# Altium schematic sheet PWM_CONTROL.SchDoc: PWM Control
size 279 x 215 mm; DrawnBy: Ethan Abraham; Engineer: Ethan Abraham; Revision: 1.0; SheetNumber: 7; SheetTotal: 7
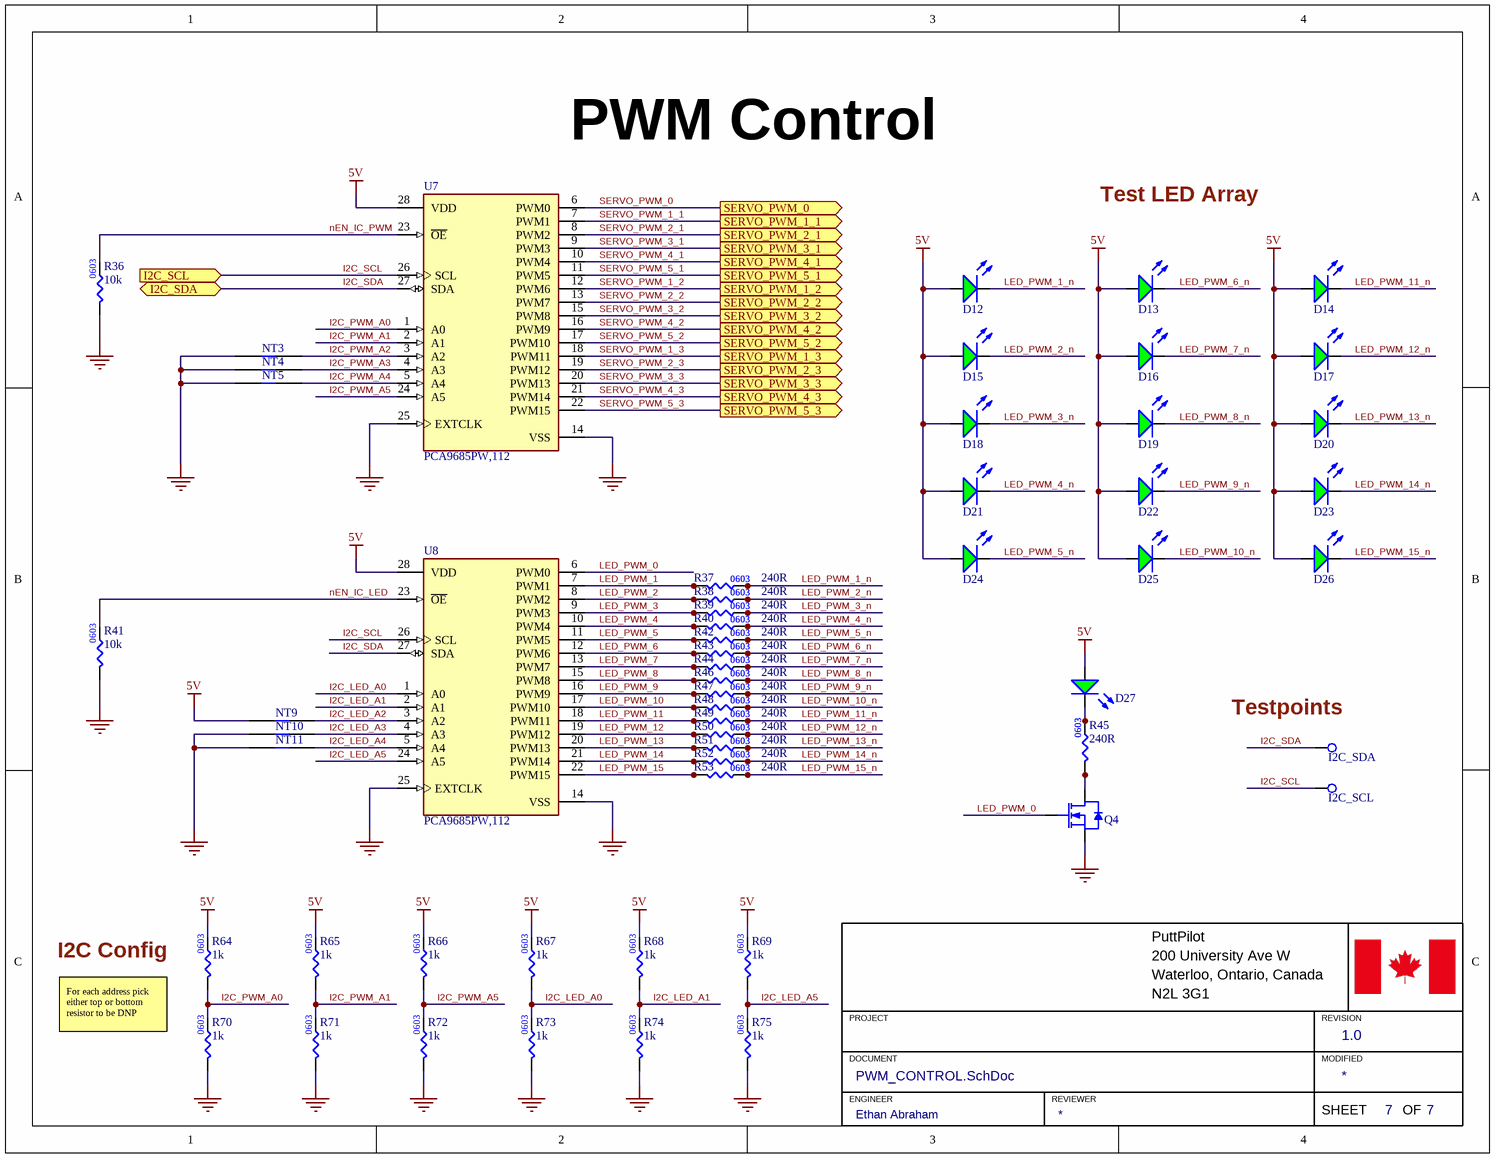
[diagram p0: PWM_CONTROL.SchDoc]

## Parts
D12  LTST-C191KGKT  [.LED_0603]  (value not drawn)
D13  LTST-C191KGKT  [.LED_0603]  (value not drawn)
D14  LTST-C191KGKT  [.LED_0603]  (value not drawn)
D15  LTST-C191KGKT  [.LED_0603]  (value not drawn)
D16  LTST-C191KGKT  [.LED_0603]  (value not drawn)
D17  LTST-C191KGKT  [.LED_0603]  (value not drawn)
D18  LTST-C191KGKT  [.LED_0603]  (value not drawn)
D19  LTST-C191KGKT  [.LED_0603]  (value not drawn)
D20  LTST-C191KGKT  [.LED_0603]  (value not drawn)
D21  LTST-C191KGKT  [.LED_0603]  (value not drawn)
D22  LTST-C191KGKT  [.LED_0603]  (value not drawn)
D23  LTST-C191KGKT  [.LED_0603]  (value not drawn)
D24  LTST-C191KGKT  [.LED_0603]  (value not drawn)
D25  LTST-C191KGKT  [.LED_0603]  (value not drawn)
D26  LTST-C191KGKT  [.LED_0603]  (value not drawn)
D27  LTST-C191KGKT  [.LED_0603]  (value not drawn)
I2C_SCL  RCWCTE  [RCWCTE]  (value not drawn)
I2C_SDA  RCWCTE  [RCWCTE]  (value not drawn)
NT3  .NET_TIE  [.NET_TIE]  (value not drawn)
NT4  .NET_TIE  [.NET_TIE]  (value not drawn)
NT5  .NET_TIE  [.NET_TIE]  (value not drawn)
NT9  .NET_TIE  [.NET_TIE]  (value not drawn)
NT10  .NET_TIE  [.NET_TIE]  (value not drawn)
NT11  .NET_TIE  [.NET_TIE]  (value not drawn)
Q4  DMN6140L-7  [.SOT-23-3]  (value not drawn)
R36  Resistance: 10k  [.RES_0603]  (hidden comment: RC0603FR-0710KL)
R37  Resistance: 240R  [.RES_0603]  (hidden comment: RC0603FR-07240RL)
R38  Resistance: 240R  [.RES_0603]  (hidden comment: RC0603FR-07240RL)
R39  Resistance: 240R  [.RES_0603]  (hidden comment: RC0603FR-07240RL)
R40  Resistance: 240R  [.RES_0603]  (hidden comment: RC0603FR-07240RL)
R41  Resistance: 10k  [.RES_0603]  (hidden comment: RC0603FR-0710KL)
R42  Resistance: 240R  [.RES_0603]  (hidden comment: RC0603FR-07240RL)
R43  Resistance: 240R  [.RES_0603]  (hidden comment: RC0603FR-07240RL)
R44  Resistance: 240R  [.RES_0603]  (hidden comment: RC0603FR-07240RL)
R45  Resistance: 240R  [.RES_0603]  (hidden comment: RC0603FR-07240RL)
R46  Resistance: 240R  [.RES_0603]  (hidden comment: RC0603FR-07240RL)
R47  Resistance: 240R  [.RES_0603]  (hidden comment: RC0603FR-07240RL)
R48  Resistance: 240R  [.RES_0603]  (hidden comment: RC0603FR-07240RL)
R49  Resistance: 240R  [.RES_0603]  (hidden comment: RC0603FR-07240RL)
R50  Resistance: 240R  [.RES_0603]  (hidden comment: RC0603FR-07240RL)
R51  Resistance: 240R  [.RES_0603]  (hidden comment: RC0603FR-07240RL)
R52  Resistance: 240R  [.RES_0603]  (hidden comment: RC0603FR-07240RL)
R53  Resistance: 240R  [.RES_0603]  (hidden comment: RC0603FR-07240RL)
R64  Resistance: 1k  [.RES_0603]  (hidden comment: RC0603FR-071KL)
R65  Resistance: 1k  [.RES_0603]  (hidden comment: RC0603FR-071KL)
R66  Resistance: 1k  [.RES_0603]  (hidden comment: RC0603FR-071KL)
R67  Resistance: 1k  [.RES_0603]  (hidden comment: RC0603FR-071KL)
R68  Resistance: 1k  [.RES_0603]  (hidden comment: RC0603FR-071KL)
R69  Resistance: 1k  [.RES_0603]  (hidden comment: RC0603FR-071KL)
R70  Resistance: 1k  [.RES_0603]  (hidden comment: RC0603FR-071KL)
R71  Resistance: 1k  [.RES_0603]  (hidden comment: RC0603FR-071KL)
R72  Resistance: 1k  [.RES_0603]  (hidden comment: RC0603FR-071KL)
R73  Resistance: 1k  [.RES_0603]  (hidden comment: RC0603FR-071KL)
R74  Resistance: 1k  [.RES_0603]  (hidden comment: RC0603FR-071KL)
R75  Resistance: 1k  [.RES_0603]  (hidden comment: RC0603FR-071KL)
U7  PCA9685PW,112  [PCA9685PW,112]
U8  PCA9685PW,112  [PCA9685PW,112]

## Ports
I2C_SCL (in), I2C_SDA (bidir), SERVO_PWM_0 (out), SERVO_PWM_1_1 (out), SERVO_PWM_1_2 (out), SERVO_PWM_1_3 (out), SERVO_PWM_2_1 (out), SERVO_PWM_2_2 (out), SERVO_PWM_2_3 (out), SERVO_PWM_3_1 (out), SERVO_PWM_3_2 (out), SERVO_PWM_3_3 (out), SERVO_PWM_4_1 (out), SERVO_PWM_4_2 (out), SERVO_PWM_4_3 (out), SERVO_PWM_5_1 (out), SERVO_PWM_5_2 (out), SERVO_PWM_5_3 (out)

## Nets
5V: D12.1(A) D13.1(A) D14.1(A) D15.1(A) D16.1(A) D17.1(A) D18.1(A) D19.1(A) D20.1(A) D21.1(A) D22.1(A) D23.1(A) D24.1(A) D25.1(A) D26.1(A) D27.1(A) NT9.1 R64.2 R65.2 R66.2 R67.2 R68.2 R69.2 U7.28(VDD) U8.28(VDD)
GND: NT3.1 NT4.1 NT5.1 NT10.1 NT11.1 Q4.2(Source) R36.1 R41.1 R70.1 R71.1 R72.1 R73.1 R74.1 R75.1 U7.14(VSS) U7.25(EXTCLK) U8.14(VSS) U8.25(EXTCLK)
I2C_LED_A0: R67.1 R73.2 U8.1(A0)
I2C_LED_A1: R68.1 R74.2 U8.2(A1)
I2C_LED_A2: NT9.2 U8.3(A2)
I2C_LED_A3: NT10.2 U8.4(A3)
I2C_LED_A4: NT11.2 U8.5(A4)
I2C_LED_A5: R69.1 R75.2 U8.24(A5)
I2C_PWM_A0: R64.1 R70.2 U7.1(A0)
I2C_PWM_A1: R65.1 R71.2 U7.2(A1)
I2C_PWM_A2: NT3.2 U7.3(A2)
I2C_PWM_A3: NT4.2 U7.4(A3)
I2C_PWM_A4: NT5.2 U7.5(A4)
I2C_PWM_A5: R66.1 R72.2 U7.24(A5)
I2C_SCL: I2C_SCL.1 U7.26(SCL) U8.26(SCL) ; port I2C_SCL
I2C_SDA: I2C_SDA.1 U7.27(SDA) U8.27(SDA) ; port I2C_SDA
LED_PWM_0: Q4.1(Gate) U8.6(PWM0)
LED_PWM_1: R37.1 U8.7(PWM1)
LED_PWM_1_n: D12.2(K) R37.2
LED_PWM_2: R38.1 U8.8(PWM2)
LED_PWM_2_n: D15.2(K) R38.2
LED_PWM_3: R39.1 U8.9(PWM3)
LED_PWM_3_n: D18.2(K) R39.2
LED_PWM_4: R40.1 U8.10(PWM4)
LED_PWM_4_n: D21.2(K) R40.2
LED_PWM_5: R42.1 U8.11(PWM5)
LED_PWM_5_n: D24.2(K) R42.2
LED_PWM_6: R43.1 U8.12(PWM6)
LED_PWM_6_n: D13.2(K) R43.2
LED_PWM_7: R44.1 U8.13(PWM7)
LED_PWM_7_n: D16.2(K) R44.2
LED_PWM_8: R46.1 U8.15(PWM8)
LED_PWM_8_n: D19.2(K) R46.2
LED_PWM_9: R47.1 U8.16(PWM9)
LED_PWM_9_n: D22.2(K) R47.2
LED_PWM_10: R48.1 U8.17(PWM10)
LED_PWM_10_n: D25.2(K) R48.2
LED_PWM_11: R49.1 U8.18(PWM11)
LED_PWM_11_n: D14.2(K) R49.2
LED_PWM_12: R50.1 U8.19(PWM12)
LED_PWM_12_n: D17.2(K) R50.2
LED_PWM_13: R51.1 U8.20(PWM13)
LED_PWM_13_n: D20.2(K) R51.2
LED_PWM_14: R52.1 U8.21(PWM14)
LED_PWM_14_n: D23.2(K) R52.2
LED_PWM_15: R53.1 U8.22(PWM15)
LED_PWM_15_n: D26.2(K) R53.2
nEN_IC_LED: R41.2 U8.23(~{OE})
nEN_IC_PWM: R36.2 U7.23(~{OE})
SERVO_PWM_0: U7.6(PWM0) ; port SERVO_PWM_0
SERVO_PWM_1_1: U7.7(PWM1) ; port SERVO_PWM_1_1
SERVO_PWM_1_2: U7.12(PWM6) ; port SERVO_PWM_1_2
SERVO_PWM_1_3: U7.18(PWM11) ; port SERVO_PWM_1_3
SERVO_PWM_2_1: U7.8(PWM2) ; port SERVO_PWM_2_1
SERVO_PWM_2_2: U7.13(PWM7) ; port SERVO_PWM_2_2
SERVO_PWM_2_3: U7.19(PWM12) ; port SERVO_PWM_2_3
SERVO_PWM_3_1: U7.9(PWM3) ; port SERVO_PWM_3_1
SERVO_PWM_3_2: U7.15(PWM8) ; port SERVO_PWM_3_2
SERVO_PWM_3_3: U7.20(PWM13) ; port SERVO_PWM_3_3
SERVO_PWM_4_1: U7.10(PWM4) ; port SERVO_PWM_4_1
SERVO_PWM_4_2: U7.16(PWM9) ; port SERVO_PWM_4_2
SERVO_PWM_4_3: U7.21(PWM14) ; port SERVO_PWM_4_3
SERVO_PWM_5_1: U7.11(PWM5) ; port SERVO_PWM_5_1
SERVO_PWM_5_2: U7.17(PWM10) ; port SERVO_PWM_5_2
SERVO_PWM_5_3: U7.22(PWM15) ; port SERVO_PWM_5_3
NetD27_2: D27.2(K) R45.2
NetQ4_3: Q4.3(Drain) R45.1

## Notes on the sheet
- Test LED Array
- (near I2C_SDA) Testpoints
- (near R64) I2C Config
- For each address pick either top or bottom resistor to be DNP
- PuttPilot
- 200 University Ave W
- PROJECT
- Waterloo, Ontario, Canada
- N2L 3G1
- REVISION
- DOCUMENT
- ENGINEER
- REVIEWER
- MODIFIED
- SHEET
- OF

## Library data of the parts
D12-D27 = LTST-C191KGKT: LED GREEN 2V 0603; Manufacturer: Vishay Lite-On; Shape: Rectangular; Lens Style: WATER CLEAR; Forward Current-Max: 30mA; Luminous Intensity-Nom: 35mcd; Number of Functions: 1; Optoelectronic Device Type: SINGLE COLOR LED; Viewing Angle: 130°; Forward Voltage-Max: 2.4V; Reverse Voltage-Max: 5V; Overall Height: 0.55mm; Supplier 1: Digikey; Manufacturer Part Number: LTST-C191KGKT; RoHS: Yes; Stock 1: 171853; Pricing 1: 1=0.22, 10=0.121, 100=0.0721, 500=0.05324, 1000=0.04748, 2000=0.04278 (USD); Mount: Surface Mount; Number of Pins: 2; Color: Green; Color@wavelength: Green; Terminal Finish: Tin; Min Operating Temperature: -55°C; Max Operating Temperature: 85°C; Packaging: Tape and Reel; JESD-609 Code: e3; Size: 1.1mm; Terminal Pitch: 1.5mm; Reach SVHC Compliant: Yes; RoHS Compliant: Yes; ComponentLink1URL: https://datasheet.ciiva.com:443/pdfs/VipMasterIC/IC/LITE/LITE-S-A0003156116/LITE-S-A0003156116-1.pdf?src-supplier=IHS+Markit; ComponentLink1Description: https://datasheet.ciiva.com:443/pdfs/VipMasterIC/IC/LITE/LITE-S-A0003156116/LITE-S-A0003156116-1.pdf?src-supplier=IHS+Markit; ComponentLink2URL: https://datasheet.ciiva.com/2109/ltst-c191kgkt-2109973.pdf?src-supplier=Digikey; ComponentLink2Description: https://datasheet.ciiva.com/2109/ltst-c191kgkt-2109973.pdf?src-supplier=Digikey; Supplier Part Number 1: 160-1446-1-ND
I2C_SCL I2C_SDA = RCWCTE: SMT Test Point; Manufacturer: KOA Speer; Resistance: 0R; Current Rating: 2A; Number of Contacts: 1; Supplier 1: Digikey; Manufacturer Part Number: RCWCTE; RoHS: Yes; Category: Chip SMD Resistors; Stock 1: 56953; Pricing 1: 1=0.2, 10=0.15, 25=0.1344, 50=0.1238, 100=0.1141, 250=0.10268, 500=0.09488, 1000=0.08781 (USD); Mount: Surface Mount; Case/Package: 1206; Case Code (Imperial): 1206; Case Code (Metric): 3216; Contact Material: Copper,Tin; Min Operating Temperature: -55°C; Max Operating Temperature: 125°C; Packaging: Tape and Reel; Termination: SMD/SMT; Series: RC; Length: 3.2mm; Width: 1.6mm; Height: 2mm; Depth: 1.6mm; Military Standard: Not; RoHS Compliant: Yes; ComponentLink1URL: https://datasheet.ciiva.com/34302/1876186-34302940.pdf?src-supplier=Jameco; ComponentLink1Description: https://datasheet.ciiva.com/34302/1876186-34302940.pdf?src-supplier=Jameco; ComponentLink2URL: https://datasheet.ciiva.com/5556/rc-5556236.pdf?src-supplier=Mouser; ComponentLink2Description: https://datasheet.ciiva.com/5556/rc-5556236.pdf?src-supplier=Mouser; ComponentLink3URL: https://datasheet.ciiva.com/26821/getdatasheetpartid-110197-26821157.pdf?src-supplier=Verical; ComponentLink3Description: https://datasheet.ciiva.com/26821/getdatasheetpartid-110197-26821157.pdf?src-supplier=Verical; Supplier Part Number 1: 2019-RCWCTECT-ND
NT3-NT5 NT9-NT11 = .NET_TIE: .GENERIC NET TIE
Q4 = DMN6140L-7: MOSFET N-CH 60V 1.6A SOT-23; Manufacturer: Diodes; Rds On Max: 140mR; Input Capacitance: 315pF; Max Power Dissipation: 700mW; Threshold Voltage: 3V; Number of Channels: 1; Gate to Source Voltage (Vgs): 20V; Fall Time: 2.7ns; Rise Time: 3.6ns; Turn-Off Delay Time: 16.3ns; Turn-On Delay Time: 2.6ns; Polarity: N-CHANNEL; Supplier 1: Future Electronics; Manufacturer Part Number: DMN6140L-7; RoHS: Yes; Category: MOSFETs; Stock 1: 624000; Pricing 1: 3000=0.0489, 9000=0.047, 15000=0.0462, 45000=0.0445, 75000=0.043 (USD); Mount: Surface Mount; Case/Package: SOT-23; Number of Pins: 3; Weight: 0.000282oz; Min Operating Temperature: -55°C; Max Operating Temperature: 150°C; Package Quantity: 1; Packaging: Tape and Reel; Drain to Source Voltage (Vdss): 60V; Continuous Drain Current (ID): 1.6A; Drain to Source Resistance: 140mR; Series: -; Reach SVHC Compliant: No; Lead Free: Lead Free; RoHS Compliant: Yes; ComponentLink1URL: https://datasheet.ciiva.com/29747/dmn6140l-29747654.pdf?src-supplier=Digikey; ComponentLink1Description: https://datasheet.ciiva.com/29747/dmn6140l-29747654.pdf?src-supplier=Digikey; ComponentLink2URL: https://datasheet.ciiva.com/29747/dmn6140l-29747660.pdf?src-supplier=Digikey; ComponentLink2Description: https://datasheet.ciiva.com/29747/dmn6140l-29747660.pdf?src-supplier=Digikey; Supplier Part Number 1: 4046633
R36 R41 = RC0603FR-0710KL: RES 10K OHM 0603; Manufacturer: Yageo; Tolerance: 1%; Additional Feature: LASER TRIMMABLE; Rated Power Dissipation (P): 100mW; Rated Temperature: 70°C; Temperature Coefficient: 100ppm/°C; Working Voltage: 75V; Package Height: 0.45mm; Package Length: 1.6mm; Package Width: 0.8mm; Supplier 1: Future Electronics; Manufacturer Part Number: RC0603FR-0710KL; RoHS: Yes; Category: Chip SMD Resistors; Stock 1: 30355000; Pricing 1: 5000=0.0026, 50000=0.0025, 150000=0.0024, 375000=0.0023, 1000000=0.0022 (USD); Mount: Surface Mount; Number of Pins: 2; Package Shape: Rectangular; Size Code: 0603; Terminal Finish: Nickel; Min Operating Temperature: -55°C; Max Operating Temperature: 155°C; JESD-609 Code: e3; Resistor Type: FIXED RESISTOR; Construction: Chip; Package Style: SMTMeter; Packaging: Tape and Reel; Technology: METAL GLAZE/THICK FILM; Termination: Wraparound; Reach SVHC Compliant: Yes; RoHS Compliant: Yes; ComponentLink1URL: https://datasheet.ciiva.com:443/pdfs/VipMasterIC/IC/YAGO/YAGO-S-A0008145938/YAGO-S-A0008145938-1.pdf?src-supplier=IHS+Markit; ComponentLink1Description: https://datasheet.ciiva.com:443/pdfs/VipMasterIC/IC/YAGO/YAGO-S-A0008145938/YAGO-S-A0008145938-1.pdf?src-supplier=IHS+Markit; ComponentLink2URL: https://datasheet.ciiva.com/22747/443971-22747519.pdf?src-supplier=Element14; ComponentLink2Description: https://datasheet.ciiva.com/22747/443971-22747519.pdf?src-supplier=Element14; ComponentLink3URL: https://datasheet.ciiva.com/46440/1868787-46440891.pdf?src-supplier=Element14; ComponentLink3Description: https://datasheet.ciiva.com/46440/1868787-46440891.pdf?src-supplier=Element14; ComponentLink4URL: https://datasheet.ciiva.com/15189/getdatasheetpartid-409289-15189591.pdf?src-supplier=Verical; ComponentLink4Description: https://datasheet.ciiva.com/15189/getdatasheetpartid-409289-15189591.pdf?src-supplier=Verical; ComponentLink5URL: https://datasheet.ciiva.com/7660/38590-7660789.pdf?src-supplier=Element14; ComponentLink5Description: https://datasheet.ciiva.com/7660/38590-7660789.pdf?src-supplier=Element14; ComponentLink6URL: https://datasheet.ciiva.com/7746/1738695-7746239.pdf?src-supplier=Element14; ComponentLink6Description: https://datasheet.ciiva.com/7746/1738695-7746239.pdf?src-supplier=Element14; ComponentLink7URL: https://datasheet.ciiva.com/7983/443971-7983596.pdf?src-supplier=Element14; ComponentLink7Description: https://datasheet.ciiva.com/7983/443971-7983596.pdf?src-supplier=Element14; Supplier Part Number 1: 4023214
R37-R40 R42-R53 = RC0603FR-07240RL: RES 240 OHM 0603; Manufacturer: Yageo; Tolerance: 1%; Additional Feature: LASER TRIMMABLE; Rated Power Dissipation (P): 100mW; Rated Temperature: 70°C; Temperature Coefficient: 100ppm/°C; Working Voltage: 75V; Package Height: 0.45mm; Package Length: 1.6mm; Package Width: 0.8mm; Supplier 1: Future Electronics; Manufacturer Part Number: RC0603FR-07240RL; RoHS: Yes; Category: Chip SMD Resistors; Stock 1: 1760000; Pricing 1: 5000=0.0026, 50000=0.0025, 150000=0.0024, 375000=0.0023, 1000000=0.0022 (USD); Mount: Surface Mount; Number of Pins: 2; Package Shape: Rectangular; Size Code: 0603; Terminal Finish: Nickel; Min Operating Temperature: -55°C; Max Operating Temperature: 155°C; JESD-609 Code: e3; Resistor Type: FIXED RESISTOR; Construction: Chip; Package Style: SMTMeter; Packaging: Tape and Reel; Technology: METAL GLAZE/THICK FILM; Termination: Wraparound; Reach SVHC Compliant: Yes; RoHS Compliant: Yes; ComponentLink1URL: https://datasheet.ciiva.com:443/pdfs/VipMasterIC/IC/YAGO/YAGO-S-A0008145938/YAGO-S-A0008145938-1.pdf?src-supplier=IHS+Markit; ComponentLink1Description: https://datasheet.ciiva.com:443/pdfs/VipMasterIC/IC/YAGO/YAGO-S-A0008145938/YAGO-S-A0008145938-1.pdf?src-supplier=IHS+Markit; ComponentLink2URL: https://datasheet.ciiva.com/2508/pyu-r-int-thick-7-2508497.pdf?src-supplier=Digikey; ComponentLink2Description: https://datasheet.ciiva.com/2508/pyu-r-int-thick-7-2508497.pdf?src-supplier=Digikey; ComponentLink3URL: https://datasheet.ciiva.com/2508/pyu-r-int-thick-7-2508498.pdf?src-supplier=Digikey; ComponentLink3Description: https://datasheet.ciiva.com/2508/pyu-r-int-thick-7-2508498.pdf?src-supplier=Digikey; ComponentLink4URL: https://datasheet.ciiva.com/2508/pyu-r-int-thick-7-2508499.pdf?src-supplier=Digikey; ComponentLink4Description: https://datasheet.ciiva.com/2508/pyu-r-int-thick-7-2508499.pdf?src-supplier=Digikey; Supplier Part Number 1: 5308184
R64-R75 = RC0603FR-071KL: RES 1K OHM 0603; Manufacturer: Yageo; Tolerance: 1%; Additional Feature: LASER TRIMMABLE; Rated Power Dissipation (P): 100mW; Rated Temperature: 70°C; Temperature Coefficient: 100ppm/°C; Working Voltage: 75V; Package Height: 0.45mm; Package Length: 1.6mm; Package Width: 0.8mm; Supplier 1: Future Electronics; Manufacturer Part Number: RC0603FR-071KL; RoHS: Yes; Category: Chip SMD Resistors; Stock 1: 12810000; Pricing 1: 5000=0.0026, 50000=0.0025, 150000=0.0024, 375000=0.0023, 1000000=0.0022 (USD); Mount: Surface Mount; Number of Pins: 2; Package Shape: Rectangular; Size Code: 0603; Terminal Finish: Nickel; Min Operating Temperature: -55°C; Max Operating Temperature: 155°C; JESD-609 Code: e3; Resistor Type: FIXED RESISTOR; Construction: Chip; Package Style: SMTMeter; Packaging: Tape and Reel; Technology: METAL GLAZE/THICK FILM; Termination: Wraparound; Reach SVHC Compliant: Yes; RoHS Compliant: Yes; ComponentLink1URL: https://datasheet.ciiva.com:443/pdfs/VipMasterIC/IC/YAGO/YAGO-S-A0008145938/YAGO-S-A0008145938-1.pdf?src-supplier=IHS+Markit; ComponentLink1Description: https://datasheet.ciiva.com:443/pdfs/VipMasterIC/IC/YAGO/YAGO-S-A0008145938/YAGO-S-A0008145938-1.pdf?src-supplier=IHS+Markit; ComponentLink2URL: https://datasheet.ciiva.com/11808/0900766b80f96399-11808081.pdf?src-supplier=Rs; ComponentLink2Description: https://datasheet.ciiva.com/11808/0900766b80f96399-11808081.pdf?src-supplier=Rs; ComponentLink3URL: https://datasheet.ciiva.com/8896/pyu-rc0603-51-rohs-l-4-8896106.pdf?src-supplier=Avnet; ComponentLink3Description: https://datasheet.ciiva.com/8896/pyu-rc0603-51-rohs-l-4-8896106.pdf?src-supplier=Avnet; ComponentLink4URL: https://datasheet.ciiva.com/7660/1868787-7660790.pdf?src-supplier=Element14; ComponentLink4Description: https://datasheet.ciiva.com/7660/1868787-7660790.pdf?src-supplier=Element14; ComponentLink5URL: https://datasheet.ciiva.com/7746/1738695-7746279.pdf?src-supplier=Element14; ComponentLink5Description: https://datasheet.ciiva.com/7746/1738695-7746279.pdf?src-supplier=Element14; ComponentLink6URL: https://datasheet.ciiva.com/7746/1686128-7746280.pdf?src-supplier=Element14; ComponentLink6Description: https://datasheet.ciiva.com/7746/1686128-7746280.pdf?src-supplier=Element14; ComponentLink7URL: https://datasheet.ciiva.com/7746/1738695-7746281.pdf?src-supplier=Element14; ComponentLink7Description: https://datasheet.ciiva.com/7746/1738695-7746281.pdf?src-supplier=Element14; ComponentLink8URL: https://datasheet.ciiva.com/7983/443971-7983613.pdf?src-supplier=Element14; ComponentLink8Description: https://datasheet.ciiva.com/7983/443971-7983613.pdf?src-supplier=Element14; ComponentLink9URL: https://datasheet.ciiva.com/15189/getdatasheetpartid-404327-15189644.pdf?src-supplier=Verical; ComponentLink9Description: https://datasheet.ciiva.com/15189/getdatasheetpartid-404327-15189644.pdf?src-supplier=Verical; Supplier Part Number 1: 4016291
U7 U8 = PCA9685PW,112: I2C LED Driver; Manufacturer: NXP Semiconductors; Package Body Material: Plastic; Data Input Mode: SERIAL; fmax-Min: 1MHz; Interface IC Type: LED DISPLAY DRIVER; Multiplexed Display Capability: No; Number of Functions: 1; Number of Segments: 16; Package Equivalence Code: TSSOP28,.25; Power Supplies: 2.5/5V; Max Supply Voltage: 5.5V; Min Supply Voltage: 2.3V; Supply Voltage-Nom: 3V; Time @ Peak Reflow Temperature-Max (s): 30s; Qualification Status: Not Qualified; Supplier 1: Newark; Manufacturer Part Number: PCA9685PW,112; RoHS: Yes; Category: LED Drivers; Stock 1: 13575; Pricing 1: 1=1.3, 10=1.3, 25=1.3, 50=1.3, 100=1.3, 250=1.29, 500=1.27 (USD); Package Code: TSSOP; Number of Pins: 28; Package Shape: Rectangular; Terminal Finish: Gold; Min Operating Temperature: -40°C; Max Operating Temperature: 85°C; JESD-609 Code: e4; JESD-30 Code: R-PDSO-G28; Moisture Sensitivity Level: 1; Package Style: SMALL OUTLINE, THIN PROFILE, SHRINK PITCHMeter; Peak Reflow Temperature (Cel): 260°C; Surface Mount: Yes; Terminal Form: Gull Wing; Terminal Position: DUAL; Length: 9.7mm; Width: 4.4mm; Height - Seated (Max): 1.1mm; Terminal Pitch: 0.65mm; Temperature Grade: INDUSTRIAL; Reach SVHC Compliant: Yes; RoHS Compliant: Yes; ComponentLink1URL: https://datasheet.ciiva.com:443/pdfs/VipMasterIC/IC/PHGL/PHGL-S-A0000775254/PHGL-S-A0000775254-1.pdf?src-supplier=IHS+Markit; ComponentLink1Description: https://datasheet.ciiva.com:443/pdfs/VipMasterIC/IC/PHGL/PHGL-S-A0000775254/PHGL-S-A0000775254-1.pdf?src-supplier=IHS+Markit; ComponentLink2URL: https://datasheet.ciiva.com/1945/pca9685-1945096.pdf?src-supplier=Digikey; ComponentLink2Description: https://datasheet.ciiva.com/1945/pca9685-1945096.pdf?src-supplier=Digikey; ComponentLink3URL: https://datasheet.ciiva.com/8125/pca9685-8125354.pdf?src-supplier=Avnet; ComponentLink3Description: https://datasheet.ciiva.com/8125/pca9685-8125354.pdf?src-supplier=Avnet; Supplier Part Number 1: 85AC2130